# Altium schematic sheet PhaseShifterA.SchDoc
size B; Organization: MASA; SheetNumber: 4; SheetTotal: 6
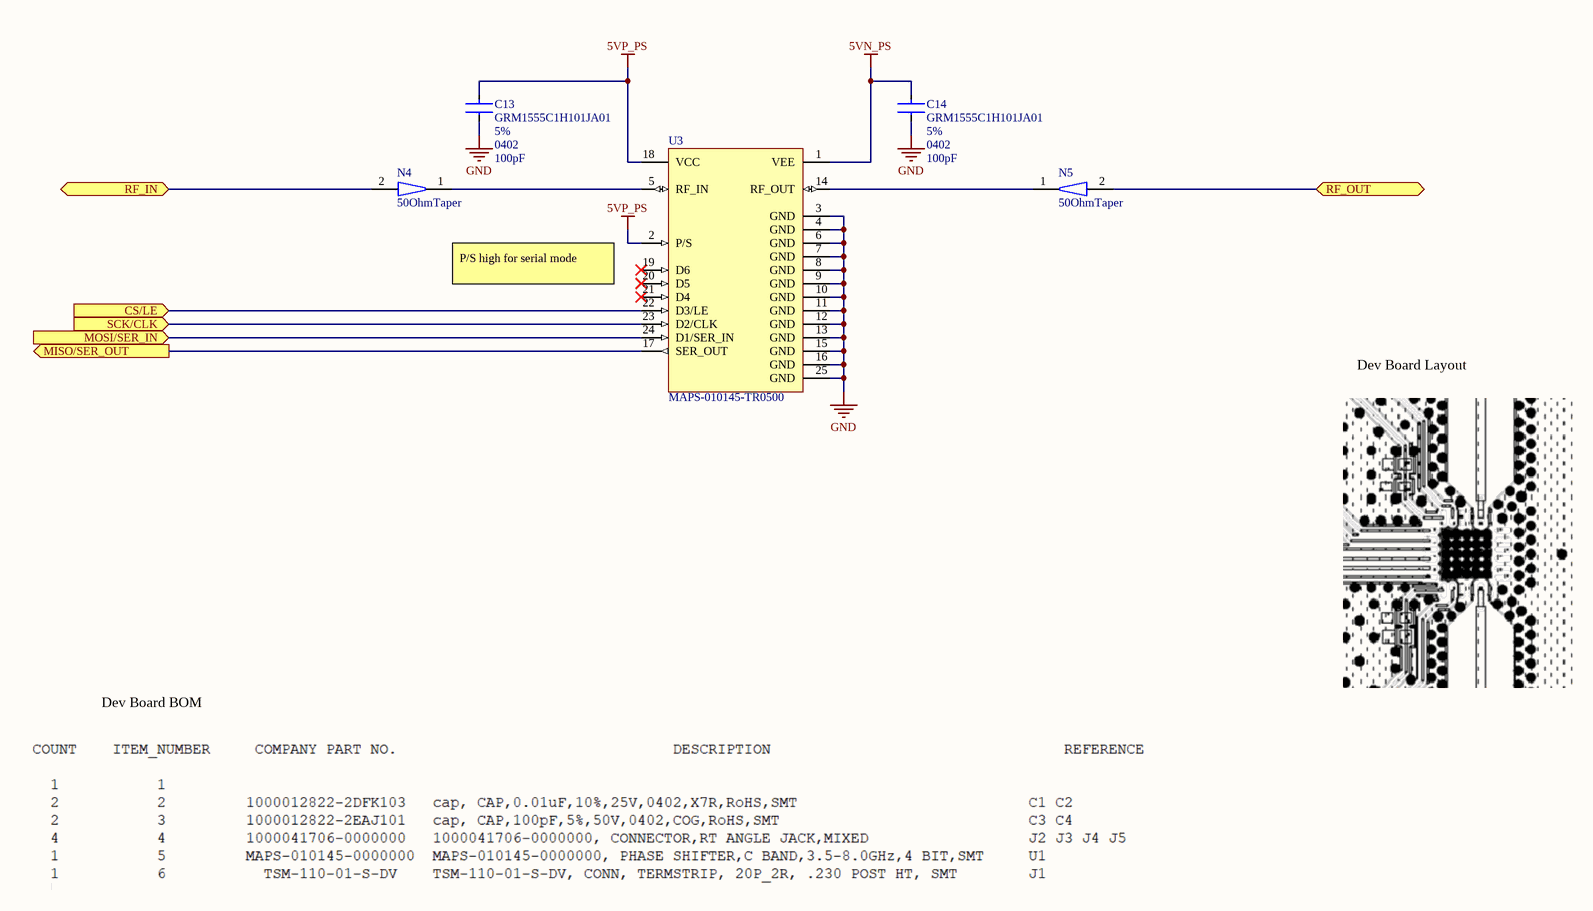
[diagram p0: PhaseShifterA.SchDoc]

## Parts
C13  GRM1555C1H101JA01  value 100pF  Tolerance: 5%  Package: 0402  [Capacitor0402_Murata]
C14  GRM1555C1H101JA01  value 100pF  Tolerance: 5%  Package: 0402  [Capacitor0402_Murata]
N4  50OhmTaper  [50OhmTaper]  (net tie, no BOM)
N5  50OhmTaper  [50OhmTaper]  (net tie, no BOM)
U3  MAPS-010145-TR0500  [MAPS-010145-TR0500_QFN50P400X400X100_HS-25N]

## Ports
CS/LE (in), MISO/SER_OUT (out), MOSI/SER_IN (in), RF_IN (bidir), RF_OUT (bidir), SCK/CLK (in)

## Nets
5VN_PS: C14.1 U3.1(VEE)
5VP_PS: C13.1 U3.2(P/S) U3.18(VCC)
GND: C13.2 C14.2 U3.3(GND) U3.4(GND) U3.6(GND) U3.7(GND) U3.8(GND) U3.9(GND) U3.10(GND) U3.11(GND) U3.12(GND) U3.13(GND) U3.15(GND) U3.16(GND) U3.25(GND)
CS/LE: U3.22(D3/LE) ; port CS/LE
MISO/SER_OUT: U3.17(SER_OUT) ; port MISO/SER_OUT
MOSI/SER_IN: U3.24(D1/SER_IN) ; port MOSI/SER_IN
RF_IN: N4.2 ; port RF_IN
RF_OUT: N5.2 ; port RF_OUT
SCK/CLK: U3.23(D2/CLK) ; port SCK/CLK
NetN4_1: N4.1 U3.5(RF_IN)
NetN5_1: N5.1 U3.14(RF_OUT)

Not connected (* = marked no-connect by the designer): U3 19(D6)* 20(D5)* 21(D4)*

## Notes on the sheet
- P/S high for serial mode
- Dev Board Layout
- Dev Board BOM
- Size: B

## Library data of the parts
C13 C14 = GRM1555C1H101JA01: 100 pF ±5% 50V Ceramic Capacitor C0G, NP0 0402 (1005 Metric); Automotive Grade: Grade 1; Temperature Characteristic: X7R; RoHS: TRUE; Material: Ceramic; Temperature Range High: +125°C; Lead Free: Yes; Category: Cap; ComponentLink2Description: Datasheet; Temperature Range Low: -55°C; Device Class L1: Passive Components; Voltage Rating: 50 V; Automotive: Yes; Device Class L3: Ceramic Capacitors; ComponentLink2URL: https://api.kemet.com/component-edge/download/datasheet/C0603C100J5GACAUTO.pdf; Device Class L2: Capacitors; Supplier 1: Avnet; Supplier Part Number 1: GRM1555C1H101JA01D
N4 N5 = 50OhmTaper: Triangular taper from 50 Ohms to 0402 width
U3 = MAPS-010145-TR0500: Phase Detectors / Shifters 3.5-6.0GHz 4-Bit Step 22.5 deg.; Supplier 1: Mouser; Supplier Part Number 1: 937-MAPS-010145-T5